# Altium schematic sheet EPS_5V_EMI-Filter_Out.SchDoc: 5V / EMI-Filter / Out
size A4
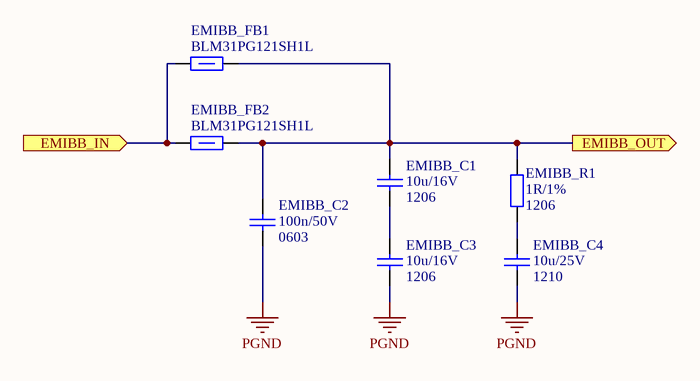
[diagram p0: EPS_5V_EMI-Filter_Out.SchDoc]

## Parts
EMIBB_C1  Packge: 1206  [SMD_Capacitor_1206]  (hidden comment: 10u/16V)
EMIBB_C2  Package: 0603  [SMD_Capacitor_0603]  (hidden comment: 100n/50V)
EMIBB_C3  Packge: 1206  [SMD_Capacitor_1206]  (hidden comment: 10u/16V)
EMIBB_C4  Package: 1210  [SMD_Capacitor_1210]  (hidden comment: 10u/25V)
EMIBB_FB1  120R/100MHz  [SMD_FerriteBead_1206]  (value not drawn)
EMIBB_FB2  120R/100MHz  [SMD_FerriteBead_1206]  (value not drawn)
EMIBB_R1  Package: 1206  [SMD_Resistor_1206]  (hidden comment: 1R/1%)

## Ports
EMIBB_IN (in), EMIBB_OUT (out)

## Nets
PGND: EMIBB_C2.2 EMIBB_C3.2 EMIBB_C4.2
EMIBB_IN: EMIBB_FB1.2 EMIBB_FB2.2 ; port EMIBB_IN
EMIBB_OUT: EMIBB_C1.1 EMIBB_C2.1 EMIBB_FB1.1 EMIBB_FB2.1 EMIBB_R1.1 ; port EMIBB_OUT
NetEMIBB_C1_2: EMIBB_C1.2 EMIBB_C3.1
NetEMIBB_C4_1: EMIBB_C4.1 EMIBB_R1.2

## Notes on the sheet
- Title:
- Project:
- Author:
- Model:
- Document Number:
- Checked by:
- Rev:
- Date:
- Approved by:
- Sheet:
- of
- File name:

## Library data of the parts
EMIBB_C1 EMIBB_C3 = Cer_C1206T106K4RACTU: Ceramic Cap Kemet COTS 10u/16V X7R 1206; ManufacturerPartNumber: C1206T106K4RACTU; Manufacturer: Kemet; Value: 10u/16V
EMIBB_C2 = Cer_C0603T104K5RALTU: Ceramic Cap Kemet COTS 100n/50V X7R 0603; Manufacturer: Kemet; ManufacturerPartNumber: C0603T104K5RALTU; Value: 100n/50V
EMIBB_C4 = Cer_GCJ32ER71E106KA12L: Ceramic Cap Murata Automotive 10u/25V X7R 1210; Manufacturer: Murata; ManufacturerPartNumber: GCJ32ER71E106KA12L; Value: 10u/25V
EMIBB_FB1 EMIBB_FB2 = BLM31PG121SH1L: Ferrite bead, 1206, 0.02HM, 3.5A.; Manufacturer: Murata; Current Rating: 3.5A; Series Resistance DC: 0.02R; Package: 1206; Value: 120R/100MHz; ManufacturerPartNumber: BLM31PG121SH1L
EMIBB_R1 = CRCW12061R00FKxxxx: 1R/1% Vishay CRCW 1206 Resistor. 250mW, 100ppm, 200V.; ManufacturerPartNumber: CRCW12061R00FKxxxx; Manufacturer: Vishay; Value: 1R/1%